# EAGLE schematic WB-test-V1 (EAGLE 9.6.2)
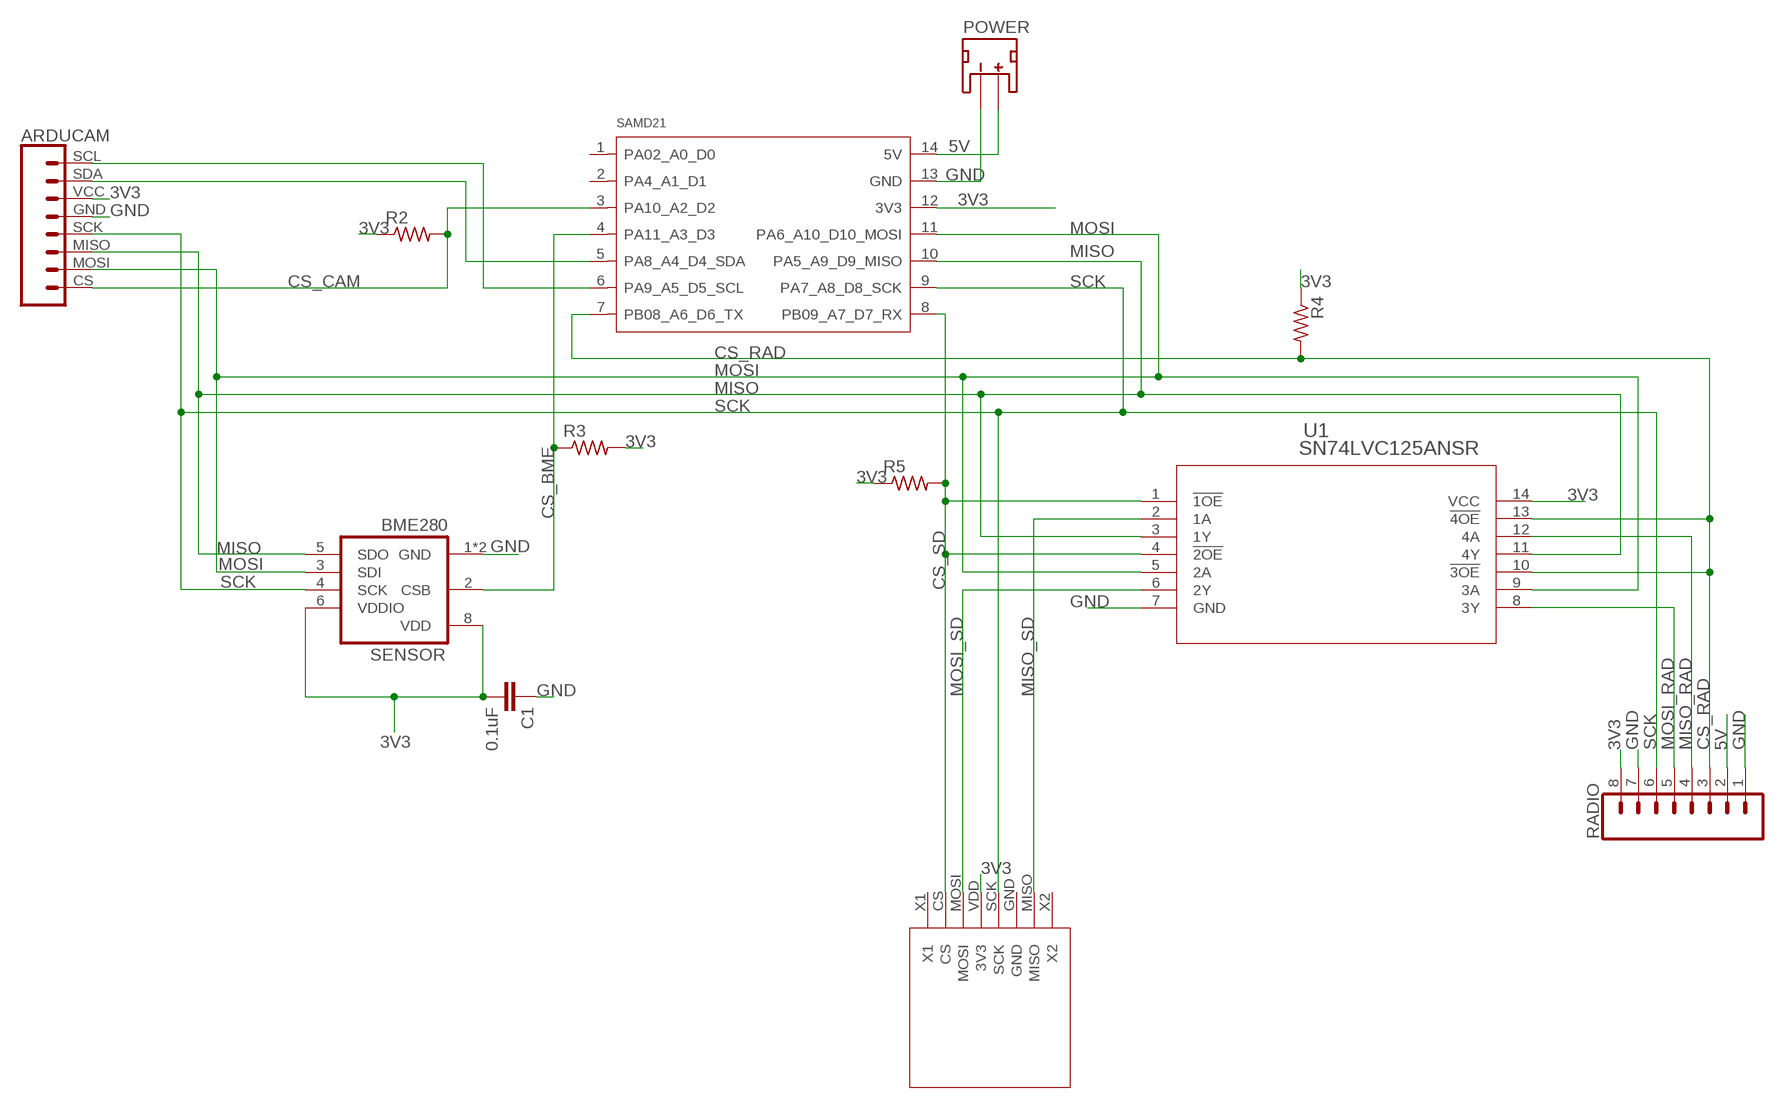
[diagram p0: schematic, sheet 1]

## Parts
C1  0.1uF  0.1UF-0402-16V-10%  [0402]
CAM  ARDUCAM_MINI  [ARDUCAM_MINI]
POWER  JST_2MM_MALE  [JST-2-SMD]
R2  R-US_R0402  [R0402]
R3  R-US_R0402  [R0402]
R4  R-US_R0402  [R0402]
R5  R-US_R0402  [R0402]
RADIO  CONN_08"  [1X08]
SAMD21  MOUDLE-SEEEDUINO-XIAO  [MOUDLE14P-2.54-21X17.8MM]
SD  SD_READER  [SDREAD]
SENSOR  BME280  [BME280]
U1  SN74LVC125ANSR  [NS14]

## Nets
3V3: C1.2 CAM.VCC R2.1 R3.2 R4.1 R5.1 RADIO.8 SAMD21.12(3V3) SD.VDD(3V3) SENSOR.6(VDDIO) SENSOR.8(VDD) U1.14(VCC)
5V: POWER.2(+) RADIO.2 SAMD21.14(5V)
CS_BME: R3.1 SAMD21.4(PA11_A3_D3) SENSOR.2(CSB)
CS_CAM: CAM.CS R2.2 SAMD21.3(PA10_A2_D2)
CS_RAD: R4.2 RADIO.3 SAMD21.7(PB08_A6_D6_TX) U1.10(!3OE) U1.13(!4OE)
CS_SD: R5.2 SAMD21.8(PB09_A7_D7_RX) SD.CS U1.1(!1OE) U1.4(!2OE)
GND: C1.1 CAM.GND POWER.1(-) RADIO.1 RADIO.7 SAMD21.13(GND) SENSOR.1(GND) SENSOR.7(GND) U1.7(GND)
MISO: CAM.MISO SAMD21.10(PA5_A9_D9_MISO) SENSOR.5(SDO) U1.3(1Y) U1.11(4Y)
MISO_RAD: RADIO.4 U1.12(4A)
MISO_SD: SD.MISO U1.2(1A)
MOSI: CAM.MOSI SAMD21.11(PA6_A10_D10_MOSI) SENSOR.3(SDI) U1.5(2A) U1.9(3A)
MOSI_RAD: RADIO.5 U1.8(3Y)
MOSI_SD: SD.MOSI U1.6(2Y)
N$5: CAM.SDA SAMD21.5(PA8_A4_D4_SDA)
N$6: CAM.SCL SAMD21.6(PA9_A5_D5_SCL)
SCK: CAM.SCK RADIO.6 SAMD21.9(PA7_A8_D8_SCK) SD.SCK SENSOR.4(SCK)
Unconnected: POWER.NC1(PAD1) POWER.NC2(PAD2) SAMD21.1(PA02_A0_D0) SAMD21.2(PA4_A1_D1) SD.GND SD.X1 SD.X2

## Library data of the parts
C1 = SparkFun-Capacitors:0.1UF: 0.1µF ceramic capacitors A capacitor is a passive two-terminal electrical component used to store electrical energy temporarily in an electric field.; PROD_ID: CAP-12416
CAM = project-library:ARDUCAM_MINI
POWER = SparkFun-Connectors:JST_2MM_MALE: JST 2MM MALE RA CONNECTOR Two pin, compact surface mount connector. Commonly used as a battery input connection point. We really like the solid locking feeling and high current rating on these small connectors. We use these all the time as battery connectors. Mates to single-cell LiPo batteries. Here is the connector we sell at SparkFun: JST Right Angle Connector - White <https://www.sparkfun.com/products/8612> (PRT-08612) Datasheet <http://www.sparkfun.com/datasheets/Prototyping/Connectors/JST-Horizontal.pdf> It was used on these SparkFun products: SparkFun MOSFET Power Controller <https://www.sparkfun.com/products/11214> (PRT-11214) SparkFun Battery Babysitter - LiPo Battery Manager <https://www.sparkfun.com/products/13777> (PRT-13777) And many, many others that required a lipo battery connection.; PROD_ID: CONN-11443; SF_ID: PRT-08612
R2-R5 = rcl:R-US_: RESISTOR, American symbol; SPICEPREFIX: R
RADIO = SparkFun-Connectors:CONN_08: Multi connection point. Often used as Generic Header-pin footprint for 0.1 inch spaced/style header connections On any of the 0.1 inch spaced packages, you can populate with these: Break Away Headers - Straight <https://www.sparkfun.com/products/116> (PRT-00116) Break Away Male Headers - Right Angle <https://www.sparkfun.com/products/553> (PRT-00553) Female Headers <https://www.sparkfun.com/products/115> (PRT-00115) Break Away Headers - Machine Pin <https://www.sparkfun.com/products/117> (PRT-00117) Break Away Female Headers - Swiss Machine Pin <https://www.sparkfun.com/products/743> (PRT-00743) Arduino Stackable Header - 8 Pin <https://www.sparkfun.com/products/9279> (PRT-09279) For SCREWTERMINALS and SPRING TERMINALS visit here: Screw Terimnals on SparkFun.com <https://www.sparkfun.com/search/results?term=Screw+Terminals> (5mm/3.5mm/2.54mm spacing) This device is also useful as a general connection point to wire up your design to another part of your project. Our various solder wires solder well into these plated through hole pads. Hook-Up Wire - Assortment (Stranded, 22 AWG) <https://www.sparkfun.com/products/11375> (PRT-11375) Hook-Up Wire - Assortment (Solid Core, 22 AWG) <https://www.sparkfun.com/products/11367> (PRT-11367) View the entire wire category on our website here <https://www.sparkfun.com/categories/141> Special notes: Molex polarized connector foot print use with SKU : PRT-08231 with associated crimp pins and housings. 1MM SMD Version SKU: PRT-10208 NOTES ON THE VARIANTS LOCK and LOCK_LONGPADS... This footprint was designed to help hold the alignment of a through-hole component (i.e. 6-pin header) while soldering it into place. You may notice that each hole has been shifted either up or down by 0.005 of an inch from it's more standard position (which is a perfectly straight line). This slight alteration caused the pins (the squares in the middle) to touch the edges of the holes. Because they are alternating, it causes a "brace" to hold the component in place. 0.005 has proven to be the perfect amount of "off-center" position when using our standard breakaway headers. Although looks a little odd when you look at the bare footprint, once you have a header in there, the alteration is very hard to notice. Also,if you push a header all the way into place, it is covered up entirely on the bottom side.; PROD_ID: CONN-08438
SAMD21 = Seeeduino-XIAO-footprint-eagle:MOUDLE-SEEEDUINO-XIAO
SD = project-library:SD_READER
SENSOR = bosch-bme280:BME280: DIGITAL HUMIDITY, PRESSURE AND TEMPERATURE SENSOR * Digital interface I²C (up to 3.4 MHz) and SPI (3 and 4 wire, up to 10 MHz)* Supply voltage VDD main supply voltage range: 1.71 V to 3.6 V*VDDIO interface voltage range: 1.2 V to 3.6 V Operating range -40…+85 °C, 0…100 % rel. humidity, 300…1100 hPa The library has been designed by Richard Magdycz <https://www.facebook.com/groups/eaglecadsoftUK>
U1 = SN74LVC125ANSR:SN74LVC125ANSR; COPYRIGHT: Copyright (C) 2024 Ultra Librarian. All rights reserved.; MANUFACTURER_PART_NUMBER: SN74LVC125ANSR; MFR_NAME: Texas Instruments